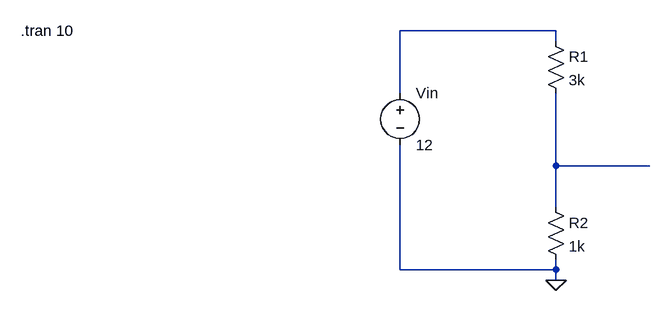
[diagram p0: schematic circuit.asc]
circuit.asc, the LTspice schematic file:
Version 4.1
SHEET 1 880 680
WIRE 288 16 48 16
WIRE 288 32 288 16
WIRE 48 112 48 16
WIRE 288 224 288 112
WIRE 432 224 288 224
WIRE 288 288 288 224
WIRE 48 384 48 192
WIRE 288 384 288 368
WIRE 288 384 48 384
WIRE 288 400 288 384
FLAG 288 400 0
DATAFLAG 288 16 ""
DATAFLAG 288 224 ""
DATAFLAG 432 224 ""
DATAFLAG 288 384 ""
DATAFLAG 128 16 "I(R1)"
DATAFLAG 384 80 "V(n001)-V(n002)"
SYMBOL voltage 48 96 R0
WINDOW 123 0 0 Left 0
WINDOW 39 0 0 Left 0
SYMATTR InstName Vin
SYMATTR Value 12
SYMBOL res 272 16 R0
SYMATTR InstName R1
SYMATTR Value 3k
SYMBOL res 272 272 R0
SYMATTR InstName R2
SYMATTR Value 1k
TEXT -536 16 Left 2 !.tran 10

The netlist it stands for:
* circuit.asc
Vin N001 0 12
R1 N001 N002 3k
R2 N002 0 1k
.tran 10
.backanno
.end